# EAGLE design neoimage_sensors small (EAGLE 9.4.2)
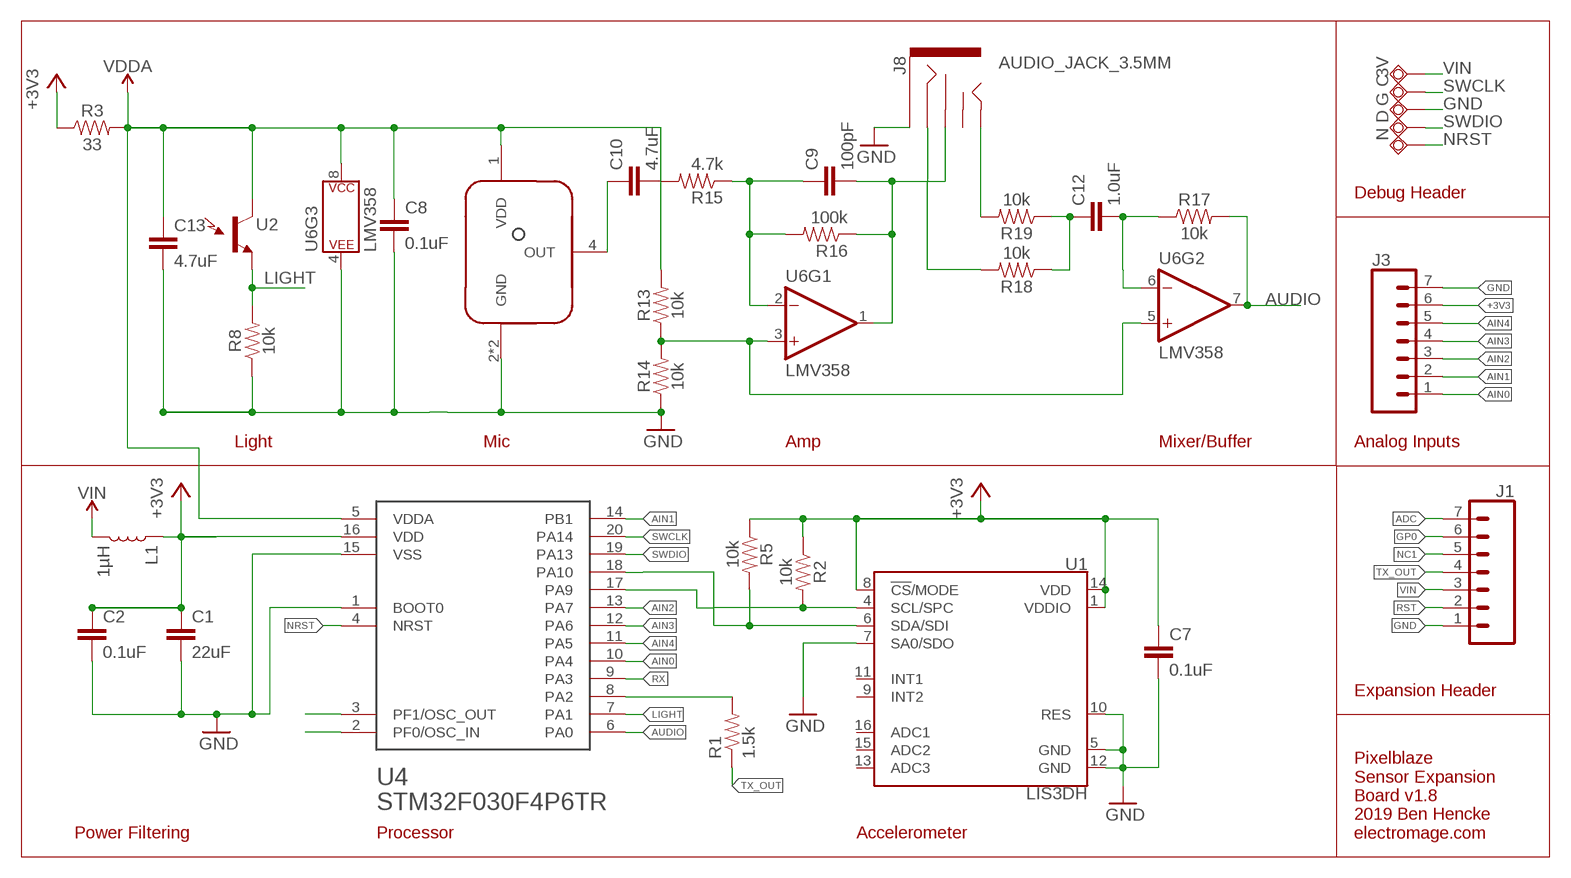
[diagram p0: schematic, sheet 1]

## Parts
3V  TPSQTP18SQ  [TP18SQ]
C  TPSQTP18SQ  [TP18SQ]
C1  22uF  22UF-0805-6.3V-20%  [0805]
C2  0.1uF  0.1UF-0603-25V-(+80/-20%)  [0603]
C7  0.1uF  0.1UF-0603-25V-(+80/-20%)  [0603]
C8  0.1uF  0.1UF-0603-25V-(+80/-20%)  [0603]
C9  100pF  100PF-0603-50V-5%  [0603]
C10  4.7uF  4.7UF0603  [0603]
C12  1.0uF  1.0UF-0603-16V-10%  [0603]
C13  4.7uF  4.7UF0603  [0603]
D  TPSQTP18SQ  [TP18SQ]
G  TPSQTP18SQ  [TP18SQ]
J1  CONN_07LOCK  [1X07_LOCK]
J3  CONN_07LOCK  [1X07_LOCK]
J8  AUDIO_JACK_3.5MM  AUDIO_JACK_3.5MM_KIT  [AUDIO-JACK-KIT]
L1  1µH  INDUCTOR-0805-3.3UH  [0805]
N  TPSQTP18SQ  [TP18SQ]
R1  1.5k  1.5KOHM-0603-1/10W-1%  [0603]
R2  10k  10KOHM-0603-1/10W-1%  [0603]
R3  33  33OHM-0603-1/10W-1%  [0603]
R5  10k  10KOHM-0603-1/10W-1%  [0603]
R8  10k  10KOHM-0603-1/10W-1%  [0603]
R13  10k  10KOHM-0603-1/10W-1%  [0603]
R14  10k  10KOHM-0603-1/10W-1%  [0603]
R15  4.7k  4.7KOHM-0603-1/10W-1%  [0603]
R16  100k  100KOHM-0603-1/10W-1%  [0603]
R17  10k  10KOHM-0603-1/10W-1%  [0603]
R18  10k  10KOHM-0603-1/10W-1%  [0603]
R19  10k  10KOHM-0603-1/10W-1%  [0603]
U1  LIS3DH  [LGA-16-3X3]
U2  LIGHT_SENSORALS  [ALS-PT19]
U4  STM32F030F4P6TR  STM32F030XTSSOP20  [TSSOP-20]
U6  LMV358  LMV358SOIC  [SO08]
U$3  MICROPHONE-MEMS  [MICROPHONE-MEMS-3X3.75]

## Nets
+3V3: C1.1 C2.1 C7.1 J3.6 L1.1 R2.1 R3.1 R5.1 U1.1(VDDIO) U1.8(!CS!/MODE) U1.14(VDD) U4.16(VDD)
ADC: J1.7
AIN0: J3.1 U4.10(PA4)
AIN1: J3.2 U4.14(PB1)
AIN2: J3.3 U4.13(PA7)
AIN3: J3.4 U4.12(PA6)
AIN4: J3.5 U4.11(PA5)
AUDIO: R17.2 U4.6(PA0) U6.7(OUT)
GND: C1.2 C2.2 C7.2 C8.2 C13.2 G.TP J1.1 J3.7 J8.SLEEVE R8.1 R14.1 U1.5(GND) U1.7(SA0/SDO) U1.10(RES) U1.12(GND) U4.1(BOOT0) U4.15(VSS) U6.4(P$V-) U$3.2(GND) U$3.3(GND)
GP0: J1.6
LIGHT: R8.2 U2.E(E1) U4.7(PA1)
MICOUT: C9.2 J8.RSH R16.1 U6.1(OUT)
N$1: U4.3(PF1/OSC_OUT)
N$2: U4.2(PF0/OSC_IN)
N$21: C10.1 U$3.4(OUT)
N$22: C9.1 R15.1 R16.2 U6.2(-IN)
N$23: C10.2 R15.2
N$24: R13.1 R14.2 U6.3(+IN) U6.5(+IN)
N$25: C12.1 R18.1 R19.1
N$26: C12.2 R17.1 U6.6(-IN)
N$27: J8.TIP R19.2
N$28: J8.RING R18.2
NC1: J1.5
NRST: N.TP U4.4(NRST)
RST: J1.2
RX: U4.9(PA3)
SCL: R5.2 U1.6(SDA/SDI) U4.18(PA10)
SDA: R2.2 U1.4(SCL/SPC) U4.17(PA9)
SWCLK: C.TP U4.20(PA14)
SWDIO: D.TP U4.19(PA13)
TX: R1.2 U4.8(PA2)
TX_OUT: J1.4 R1.1
VDDA: C8.1 C13.1 R3.2 R13.2 U2.C(C1) U4.5(VDDA) U6.8(P$V+) U$3.1(VDD)
VIN: 3V.TP J1.3 L1.2
Unconnected: J8.TSH U1.9(INT2) U1.11(INT1) U1.13(ADC3) U1.15(ADC2) U1.16(ADC1)

## Notes on the sheet
- Debug Header
- Light | Mic | Amp | Mixer/Buffer | Analog Inputs
- Expansion Header
- Power Filtering | Processor | Accelerometer
- Pixelblaze
  Sensor Expansion 
  Board v1.8
  2019 Ben Hencke
  electromage.com

## Library data of the parts
3V C D G N = testpad:TPSQ: Test pad
C1 = SparkFun-Capacitors:22UF: 22µF ceramic capacitors A capacitor is a passive two-terminal electrical component used to store electrical energy temporarily in an electric field.; PROD_ID: CAP-08402
C2 C7 C8 = SparkFun-Capacitors:0.1UF: 0.1µF ceramic capacitors A capacitor is a passive two-terminal electrical component used to store electrical energy temporarily in an electric field.; PROD_ID: CAP-00810
C9 = SparkFun-Capacitors:100PF: 100pF/0.1nF ceramic capacitors A capacitor is a passive two-terminal electrical component used to store electrical energy temporarily in an electric field.; PROD_ID: CAP-07883
C10 C13 = SparkFun-Capacitors:4.7UF: 4.7µF ceramic capacitors A capacitor is a passive two-terminal electrical component used to store electrical energy temporarily in an electric field.; PROD_ID: CAP-08280
C12 = SparkFun-Capacitors:1.0UF: 1µF ceramic capacitors A capacitor is a passive two-terminal electrical component used to store electrical energy temporarily in an electric field.; PROD_ID: CAP-00868
J1 J3 = SparkFun-Connectors:CONN_07: Multi connection point. Often used as Generic Header-pin footprint for 0.1 inch spaced/style header connections On any of the 0.1 inch spaced packages, you can populate with these: Break Away Headers - Straight <https://www.sparkfun.com/products/116> (PRT-00116) Break Away Male Headers - Right Angle <https://www.sparkfun.com/products/553> (PRT-00553) Female Headers <https://www.sparkfun.com/products/115> (PRT-00115) Break Away Headers - Machine Pin <https://www.sparkfun.com/products/117> (PRT-00117) Break Away Female Headers - Swiss Machine Pin <https://www.sparkfun.com/products/743> (PRT-00743) For SCREWTERMINALS and SPRING TERMINALS visit here: Screw Terimnals on SparkFun.com <https://www.sparkfun.com/search/results?term=Screw+Terminals> (5mm/3.5mm/2.54mm spacing) This device is also useful as a general connection point to wire up your design to another part of your project. Our various solder wires solder well into these plated through hole pads. Hook-Up Wire - Assortment (Stranded, 22 AWG) <https://www.sparkfun.com/products/11375> (PRT-11375) Hook-Up Wire - Assortment (Solid Core, 22 AWG) <https://www.sparkfun.com/products/11367> (PRT-11367) View the entire wire category on our website here <https://www.sparkfun.com/categories/141> Special notes: Molex polarized connector foot print use with SKU : PRT-08231 with associated crimp pins and housings. 1MM SMD Version SKU: PRT-10208 NOTES ON THE VARIANTS LOCK and LOCK_LONGPADS... This footprint was designed to help hold the alignment of a through-hole component (i.e. 6-pin header) while soldering it into place. You may notice that each hole has been shifted either up or down by 0.005 of an inch from it's more standard position (which is a perfectly straight line). This slight alteration caused the pins (the squares in the middle) to touch the edges of the holes. Because they are alternating, it causes a "brace" to hold the component in place. 0.005 has proven to be the perfect amount of "off-center" position when using our standard breakaway headers. Although looks a little odd when you look at the bare footprint, once you have a header in there, the alteration is very hard to notice. Also,if you push a header all the way into place, it is covered up entirely on the bottom side.
J8 = SparkFun-Connectors:AUDIO_JACK_3.5MM: Audio Jack 3.5mm variants of PTH and SMT stereo audio jack with bypass switches. SparkFun Products: SparkFun SparkPunk Sound Kit <[https://www.sparkfun.com/products/11177]> - PTH MP3 Trigger <https://www.sparkfun.com/products/13720> -3.5mm SMD SparkFun PicoBoard <https://www.sparkfun.com/products/11888>- 2.5mm SMD; PROD_ID: CONN-08774; SF_ID: PRT-08032
L1 = SparkFun-Coils:INDUCTOR: Inductors Resist changes in electrical current. Basically a coil of wire. SparkFun Products: SparkFun Load Cell Amplifier - HX711 <https://www.sparkfun.com/products/13879> IOIO-OTG - V2.2 <https://www.sparkfun.com/products/13613>; PROD_ID: NDUC-13076; VALUE: 3.3µH/±20%/450mA
R1 = SparkFun-Resistors:1.5KOHM: 1.5kΩ resistor A resistor is a passive two-terminal electrical component that implements electrical resistance as a circuit element. Resistors act to reduce current flow, and, at the same time, act to lower voltage levels within circuits. - Wikipedia; PROD_ID: RES-08306
R2 R5 R8 R13 R14 R17-R19 = SparkFun-Resistors:10KOHM: 10kΩ resistor A resistor is a passive two-terminal electrical component that implements electrical resistance as a circuit element. Resistors act to reduce current flow, and, at the same time, act to lower voltage levels within circuits. - Wikipedia; PROD_ID: RES-00824
R3 = SparkFun-Resistors:33OHM: 33Ω resistor A resistor is a passive two-terminal electrical component that implements electrical resistance as a circuit element. Resistors act to reduce current flow, and, at the same time, act to lower voltage levels within circuits. - Wikipedia; PROD_ID: RES-08270
R15 = SparkFun-Resistors:4.7KOHM: 4.7kΩ resistor A resistor is a passive two-terminal electrical component that implements electrical resistance as a circuit element. Resistors act to reduce current flow, and, at the same time, act to lower voltage levels within circuits. - Wikipedia; PROD_ID: RES-07857
R16 = SparkFun-Resistors:100KOHM: 100kΩ resistor A resistor is a passive two-terminal electrical component that implements electrical resistance as a circuit element. Resistors act to reduce current flow, and, at the same time, act to lower voltage levels within circuits. - Wikipedia; PROD_ID: RES-07828
U1 = SparkFun-Sensors:LIS3DH: ST Microelectronics LIS3DH 3-Axis ±2/4/8/16g SPI/I2C Accelerometer The LIS3DH is a three axis MEMS linear accelerometer in the "nano" family. It has a digital I2C/SPI serial interface which makes it ideal for using in embedded applications. The device also features ultra low-power operational modes that allow advanced power saving and smart sleep to wake-up functions, built in detections with interrupts, and auxiliary ADC inputs Datasheet-XXXX <http://www.sparkfun.com/datasheets/Sensors/Accelerometer/LIS3DH.pdf> SparkFun Products SparkFun Triple Axis Accelerometer Breakout - LIS3DH <https://www.sparkfun.com/products/10345> (SEN-XXXXX) Triple Axis Accelerometer - LIS3DH <https://www.sparkfun.com/products/9755> (SEN-XXXXX); PROD_ID: IC-13419; SF_ID: N/A
U2 = SparkFun-Sensors:LIGHT_SENSOR: Ambient Light Sensors - Phototransistors Low cost ambient light sensors, consisting of a phototransistor in miniature SMD packages. Output voltage varies with light intensity. SparkFun Products ALS-PT19 Light Sensor <https://www.sparkfun.com/products/12566> (SEN-12566) Ambient Light Sensor - TEMT6000 <https://www.sparkfun.com/products/8348> (SEN-08348) SparkFun Ambient Light Sensor Breakout - TEMT60000 <https://www.sparkfun.com/products/8688> (SEN-08688); PROD_ID: IC-11836; SF_ID: SEN-12566
U4 = stm32f030x:STM32F030X
U6 = SparkFun-IC-Amplifiers:LMV358: IC LMV358 DUAL OP AMP Jellybean rail-to-rail output op-amp SparkFun Products SparkFun PicoBoard <https://www.sparkfun.com/products/11888> (WIG-11888) SparkFun Vernier Interface Shield <https://www.sparkfun.com/products/12858> (DEV-12858) SparkFun Blynk Board - ESP8266 <https://www.sparkfun.com/products/13794> (WRL-13794) SparkFun Digital Sandbox <https://www.sparkfun.com/products/12651> (DEV-12651 RoHS); PROD_ID: IC-09657
U$3 = bens:MICROPHONE-MEMS

## Net classes
1 power: width 0.635 mm

## Board
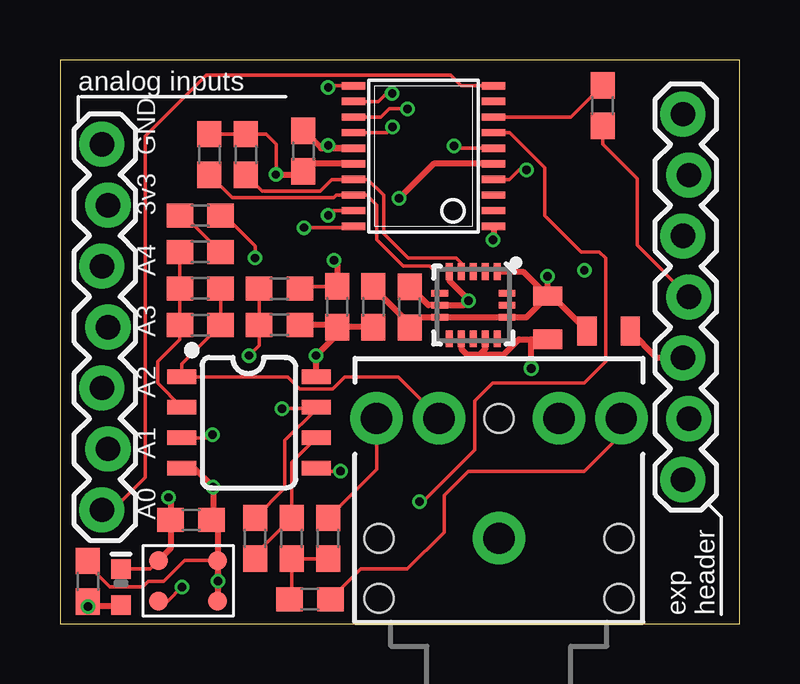
[diagram p1: board, top side]
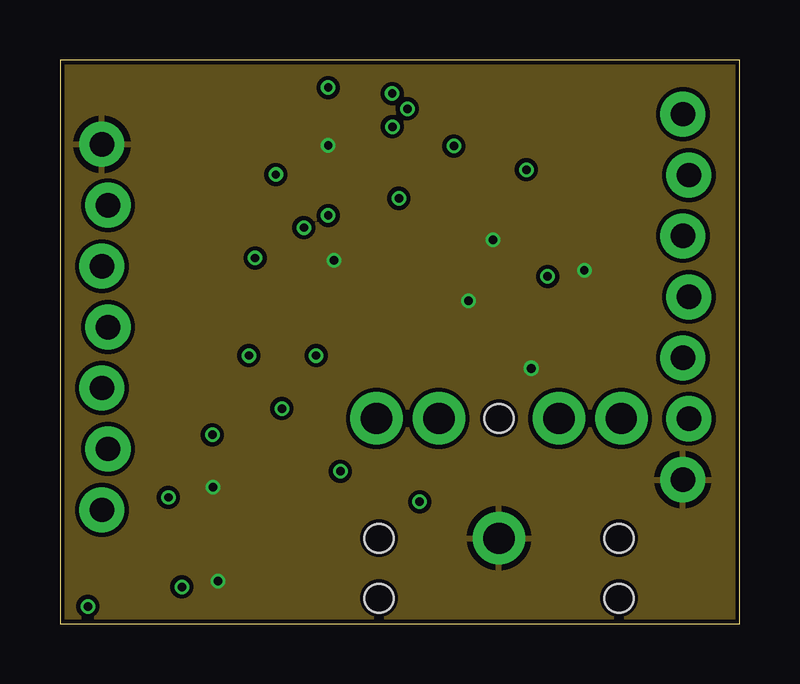
[diagram p2: board, inner layer Route2]
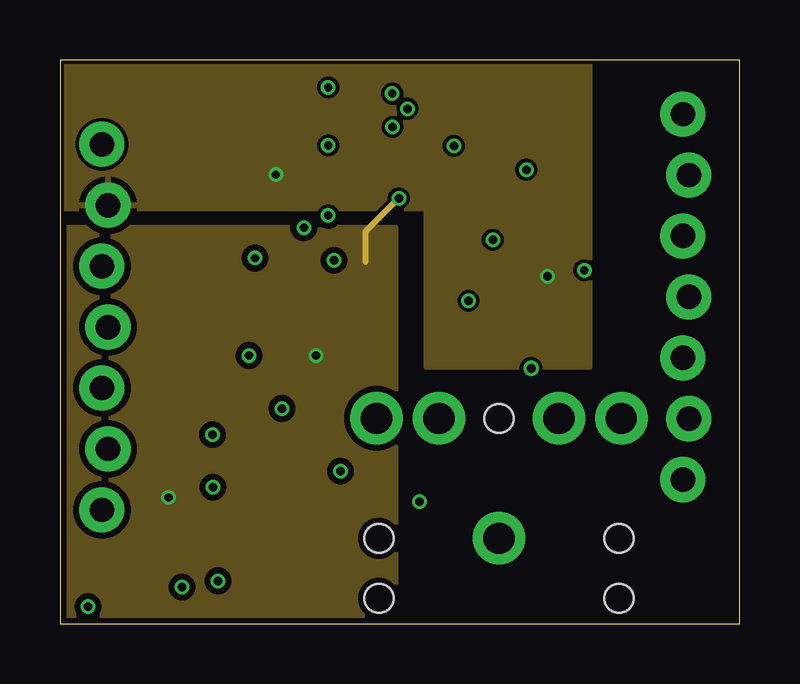
[diagram p3: board, inner layer Route15]
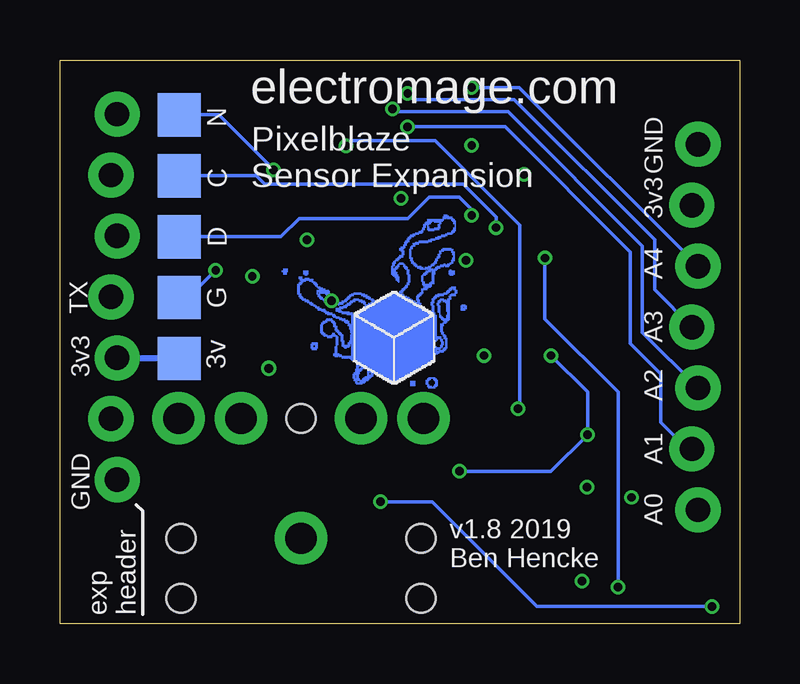
[diagram p4: board, bottom side, seen from below]

Size 28.33 x 23.5 mm. Coordinates in mm from the lower left corner, seen from the top.
Outline: 0,0 1.27,0 28.33,0 28.33,23.5 0,23.5 0,0
Copper layers (1*2*15*16): Top 0.035559375mm / dielectric 0.47751875mm / Route2 0.035559375mm / dielectric 0.47751875mm / Route15 0.035559375mm / dielectric 0.47751875mm / Bottom 0.035559375mm
Design rules "SparkFun-4-layer-FAB-LIMIT": minimum track width 4mil, minimum drill 6mil, track to track 5mil, track to pad 5mil, pad to pad 5mil, via to via 5mil, smd to smd 5mil, copper to edge 4mil, drill to drill 4mil, minimum pad ring 5mil, minimum via ring 5mil, stop-mask expansion 4mil, vias tented up to drill 25mil, thermal gap 10mil

### Footprints (pad centres in the part's own frame; a part is rotated, then mirrored left to right if it is on the bottom)
TP18SQ = smd 1.8 x 1.8: TP 0,0
0805 = smd 0.8 x 1.2: 1 -0.9,0; 2 0.9,0
0603 = smd 1.1 x 1: 1 -0.85,0; 2 0.85,0
1X07_LOCK = drill 1.016 pad 1.88: 1 0,0.127; 2 2.54,-0.127; 3 5.08,0.127; 4 7.62,-0.127; 5 10.16,0.127; 6 12.7,-0.127; 7 15.24,0.127
AUDIO-JACK-KIT = drill 1.3 pad 2.184: RING 5,5.1; RSH 5,2.5; SLEEVE 0,0; TIP 5,-5.1; TSH 5,-2.5 | hole 1.2: 0,5; -2.5,5; -2.5,-5; 0,-5; 5,0
LGA-16-3X3 = smd 0.7 x 0.28: 1 -1.4,1; 2 -1.4,0.5; 3 -1.4,0; 4 -1.4,-0.5; 5 -1.4,-1; 9 1.4,-1; 10 1.4,-0.5; 11 1.4,0; 12 1.4,0.5; 13 1.4,1 | smd 0.28 x 0.7: 6 -0.5,-1.4; 7 0,-1.4; 8 0.5,-1.4; 14 0.5,1.4; 15 0,1.4; 16 -0.5,1.4
ALS-PT19 = smd 0.8 x 0.8: C -0.75,0; E 0.75,0
TSSOP-20 = smd 0.305 x 0.991: 1 -2.925,-2.918; 2 -2.275,-2.918; 3 -1.625,-2.918; 4 -0.975,-2.918; 5 -0.325,-2.918; 6 0.325,-2.918; 7 0.975,-2.918; 8 1.625,-2.918; 9 2.275,-2.918; 10 2.925,-2.918; 11 2.925,2.918; 12 2.275,2.918; 13 1.625,2.918; 14 0.975,2.918; 15 0.325,2.918; 16 -0.325,2.918; 17 -0.975,2.918; 18 -1.625,2.918; 19 -2.275,2.918; 20 -2.925,2.918
SO08 = smd 0.6 x 1.2: 1 -1.905,-2.8; 2 -0.635,-2.8; 3 0.635,-2.8; 4 1.905,-2.8; 5 1.905,2.8; 6 0.635,2.8; 7 -0.635,2.8; 8 -1.905,2.8
MICROPHONE-MEMS-3X3.75 = smd 0.8 x 0.8: 1 0.85,1.73; 2 0.85,-0.73; 3 -0.85,-0.73; 4 -0.85,1.73

### Placement (x,y rotation side)
3V  23.37,11.05 270 bottom
C  23.37,18.67 270 bottom
C1  20.32,12.75 270 top
C2  14.57,13.2 90 top
C7  10.14,19.7 90 top
C8  5.46,4.32 0 top
C9  5.84,13.97 0 top
C10  5.84,17.02 180 top
C12  9.65,3.56 90 top
C13  11.56,13.21 90 top
D  23.37,16.13 270 bottom
G  23.37,13.59 270 bottom
J1  26.08,6 90 top
J3  1.87,4.74 90 top
J8  18.29,3.56 90 top
L1  22.86,12.19 0 top
N  23.37,21.21 270 bottom
R1  22.61,21.59 90 top
R2  7.75,19.56 270 top
R3  13.06,13.21 270 top
R5  6.22,19.56 270 top
R8  1.17,1.77 270 top
R13  9.14,12.45 0 top
R14  9.14,13.97 180 top
R15  5.84,15.49 0 top
R16  5.84,12.45 180 top
R17  8.13,3.56 90 top
R18  11.18,3.56 90 top
R19  10.41,1.02 0 top
U1  17.22,13.27 270 top
U2  2.54,1.52 270 top
U4  15.15,19.49 90 top
U6  7.87,8.38 270 top
U$3  5.84,1.78 90 top
U$4  [ELECTRO_MAGE_PCB4_PIXEL_2#PNG]  15.24,13.46 0 bottom

### Tracks (layer width: path | path; a pad name or v marks a point on that pad's centre or on a via)
+3V3  (via drill 0.35)
  Top 0.152: R5.1 R2.1 8.59,20.41 9,20 v9,18.73 v8.99,18.72
  Top 0.254: U1.1 19.3,14.67 C1.1 | C1.1 19.44,12.77 U1.14 U1.8 15,12.77 C2.1 14.57,12.49 13.06,14.01 R3.1 | C1.1 20.5,13.65 L1.1 | C1.1 v20.32,14.48 | v8.99,18.72 10.02,18.72 C7.1 10.46,19.17 U4.16
  pour Route15 (isolate 0.152): -1.27,24.13 22.1,24.13 22.1,10.67 15.24,10.67 15.24,17.27 -1.27,17.27
AIN0
  Top 0.152: U4.10 16.72,22.42 16.28,22.86 6.09,22.86 3.56,20.32 3.56,6.1 2.2,4.74 J3.1
AIN1  (via drill 0.35)
  Top 0.152: v13.85,20.71 13.85,20.69 13.63,20.47 U4.14
  Bottom 0.152: v13.85,20.71 9.79,20.71 4.57,15.49 4.57,13.72 4.57,13.15 4.57,11.68 3.3,10.41 3.3,8.38 2.2,7.28 J3.2
AIN2  (via drill 0.35)
  Top 0.152: U4.13 13.37,21.12 13.72,21.46 v14.48,21.46
  Bottom 0.152: J3.3 4.06,12.14 4.06,15.75 9.65,21.34 14.35,21.34 v14.48,21.46
AIN3  (via drill 0.35)
  Top 0.152: U4.12 13.26,21.77 13.59,22.1 v13.84,22.1
  Bottom 0.152: J3.4 3.56,13.92 3.56,16 9.4,21.84 13.59,21.84 v13.84,22.1
AIN4  (via drill 0.35)
  Top 0.152: U4.11 11.24,22.42 v11.18,22.35
  Bottom 0.152: J3.5 9.2,22.35 v11.18,22.35
AUDIO  (via drill 0.35)
  Top 0.152: R17.2 9.37,5.65 9.37,7.63 10.67,8.93 U6.7 10.62,8.97 v9.25,8.97 | v16.41,19.91 16.45,19.91 16.54,19.82 U4.6
  Bottom 0.152: v9.25,8.97 9.17,9.04 9.17,16.61 12.69,20.13 16.19,20.13 v16.41,19.91
GND  (via drill 0.35, 0.38)
  Top 0.152: v6.57,1.78 U$3.3 | R14.1 10.08,14.06 C13.2 | R8.1 1.17,2.44 2.08,1.52 3.45,1.52 3.68,1.75 4.32,1.75 5.19,2.63 U$3.2
  Top 0.254: 16.96,11.22 17.49,11.22 | 16.96,11.22 16.72,11.45 | U1.10 16.72,11.45 | 17.49,11.22 17.72,11.45 U1.12 | 16.96,11.22 17.49,11.22 | 16.96,11.22 17.49,11.22 | 16.72,11.45 16.96,11.22 | 17.49,11.22 18.49,11.22 19.12,11.85 C1.2 19.63,11.85 v19.63,10.64 | U4.1 18.07,16.03 v18.03,16 | 17.02,13.48 v17.02,13.46 | v11.42,15.15 11.56,15.01 C13.2 | 17.02,13.48 16.81,13.27 U1.7 15.35,13.27 C2.2 | 17.02,13.48 17.02,13.5 16.23,14.29 U1.5 | C7.2 10.88,19.82 U4.15 11.3,19.82 v11.18,19.94 | U6.4 5.59,6.48 v6.38,5.69 6.38,4.38 C8.2 6.57,4.06 U$3.2 v6.57,1.78 | v6.58,1.78 v6.57,1.77 U$3.3
  Bottom 0.152: G.TP 22.99,13.59 v21.84,14.73
  pour Route2 (isolate 0.178): 0,24.13 28.45,24.13 28.45,-1.27 0,-1.27
LIGHT  (via drill 0.35)
  Top 0.152: U4.7 18.73,20.47 20.19,19.01 20.19,17.02 21.72,15.49 22.48,15.49 22.73,15.24 22.73,10.92 21.84,10.03 18.03,10.03 17.27,9.27 17.27,7.24 15.11,5.08 v14.99,5.08 | R8.2 v1.17,0.71
  Top 0.254: U2.E 2.48,0.71 v1.17,0.71
  Bottom 0.152: v14.99,5.08 12.83,5.08 8.46,0.71 v1.17,0.71
MICOUT
  Top 0.152: J8.RSH 15.75,8.6 15.75,8.64 14.1,10.29 11.86,10.29 11.36,9.78 9.99,9.78 9.49,10.29 U6.1 5.07,10.83 R16.1 C9.2
N$21  (via drill 0.35)
  Top 0.152: U$3.4 4.48,0.93 v5.08,1.52 | v8.13,15.24 8.13,15.75 6.86,17.02 C10.1
  Bottom 0.152: v5.08,1.52 5.08,9.65 8.13,12.7 v8.13,15.24
N$22
  Top 0.152: R15.1 C9.1 R16.2 4.99,11.85 4.06,10.92 4.06,10.03 U6.2
N$23
  Top 0.152: C10.2 5.17,17.02 R15.2
N$24  (via drill 0.35)
  Top 0.152: R14.2 R13.1 8.29,11.6 v7.87,11.18 | v6.35,7.87 6.22,7.75 U6.3 | v11.68,6.35 10.8,6.35 U6.5
  Bottom 0.152: v7.87,11.18 6.35,9.65 v6.35,7.87 7.87,6.35 v11.68,6.35
N$25
  Top 0.152: R18.1 C12.1 9.65,1.1 R19.1
N$26
  Top 0.152: U6.6 9.65,6.72 C12.2 8.13,2.88 R17.1
N$27
  Top 0.152: R19.2 12.53,2.29 14.48,2.29 16,3.81 16,5.33 17.02,6.35 21.84,6.35 23.39,7.89 J8.TIP
N$28
  Top 0.152: R18.2 13.19,6.42 J8.RING
NRST  (via drill 0.35)
  Top 0.152: U4.4 18.08,18.51 18.72,18.51 19.14,18.92 v19.43,18.92
  Bottom 0.152: v19.43,18.92 21.72,21.21 N.TP
SCL
  Top 0.152: R5.2 7.17,17.76 11.41,17.76 11.52,17.87 U4.18 12.79,17.87 12.92,17.74 13.21,17.45 13.21,16 14.3,14.91 15.4,14.91 15.67,14.64 15.67,13.93 U1.6
SDA
  Top 0.152: R2.2 8.42,18.04 10.83,18.04 11.31,18.52 U4.17 12.83,18.52 13.49,17.86 13.49,16.26 14.5,15.24 16.51,15.24 16.72,15.03 U1.4
SWCLK  (via drill 0.35)
  Top 0.152: v10.16,16.51 12.17,16.51 U4.20
  Bottom 0.152: v10.16,16.51 10.16,16.95 11.53,18.32 19.79,18.32 20.14,18.67 C.TP
SWDIO  (via drill 0.35)
  Top 0.152: v11.18,17.02 11.38,17.22 U4.19
  Bottom 0.152: v11.18,17.02 11.18,17.27 11.69,17.78 12.95,17.78 13.84,16.89 18.37,16.89 19.13,16.13 D.TP
TX
  Top 0.152: R1.2 21.28,21.12 U4.8
TX_OUT
  Top 0.152: J1.4 24.05,15.78 24.05,18.54 22.61,19.98 R1.1
VDDA  (via drill 0.35)
  Top 0.152: U2.C 3.76,2.27 U$3.1
  Top 0.254: R3.2 C13.1 | C13.1 11.47,12.45 R13.2 | U6.8 v10.67,11.17 | v10.67,11.17 v10.67,11.18 | C13.1 11.56,12.05 v10.67,11.17 | U4.5 15.57,19.17 14.13,17.73 v14.12,17.73 | v4.52,5.26 4.61,5.17 C8.1 4.61,3.13 U$3.1
  Route15 0.254: v14.12,17.73 12.72,16.34 12.72,15.09
  pour Route15 (isolate 0.254, rank 3): -1.27,16.51 13.97,16.51 13.97,0 -1.27,0
VIN
  Top 0.254: J1.3 24.87,11.08 L1.2
  Bottom 0.254: 3V.TP 25.92,11.05 J1.3

### Text on the board
tNames: analog inputs | GND | 3v3 | A4 | A3 | A2 | A1 | A0 | exp / header
bNames: electromage.com | N | GND | 3v3 | C | Pixelblaze / Sensor Expansion | D | A4 | G | TX | A3 | 3v | 3v3 | A2 | A1 | GND | A0 | v1.8 2019 / Ben Hencke | exp / header